# EAGLE schematic pll (EAGLE 6.6.0)
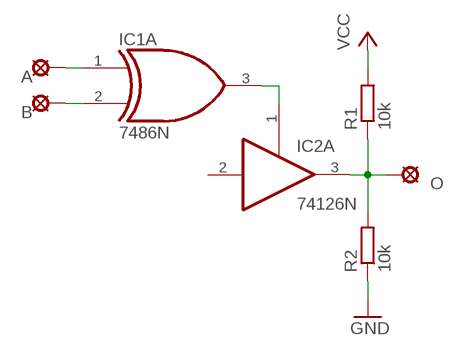
[diagram p0: schematic, sheet 1]

## Parts
A  LSP11  [LSP11]
B  LSP11  [LSP11]
IC1  7486N  [DIL14]
IC2  74126N  [DIL14]
O  LSP11  [LSP11]
R1  10k  R-EU_0204/7  [0204/7]
R2  10k  R-EU_0204/7  [0204/7]

## Nets
GND: R2.1
N$1: IC1.3(A:O) IC2.1(A:OE)
N$2: A.MP IC1.1(A:I0)
N$3: B.MP IC1.2(A:I1)
N$4: IC2.3(A:O) O.MP R1.1 R2.2
VCC: R1.2
Unconnected: IC1.4(B:I0) IC1.5(B:I1) IC1.6(B:O) IC1.8(C:O) IC1.9(C:I0) IC1.10(C:I1) IC1.11(D:O) IC1.12(D:I0) IC1.13(D:I1) IC2.2(A:I) IC2.4(B:OE) IC2.5(B:I) IC2.6(B:O) IC2.8(C:O) IC2.9(C:I) IC2.10(C:OE) IC2.11(D:O) IC2.12(D:I) IC2.13(D:OE)

## Power pins joined to a net without a drawn wire
GND: IC1.7(P:GND) IC2.7(P:GND)
VCC: IC1.14(P:VCC) IC2.14(P:VCC)

## Library data of the parts
A B O = solpad:LSP11: SOLDER PAD drill 1.1 mm
IC1 = 74xx-us:74*86: Quad 2-input EXCLUSIV-OR (XOR) gate
IC2 = 74xx-us:74*126: Quad bus BUFFER, 3-state
R1 R2 = rcl:R-EU_: RESISTOR, European symbol